# Altium project PSat PSU.PrjPcb
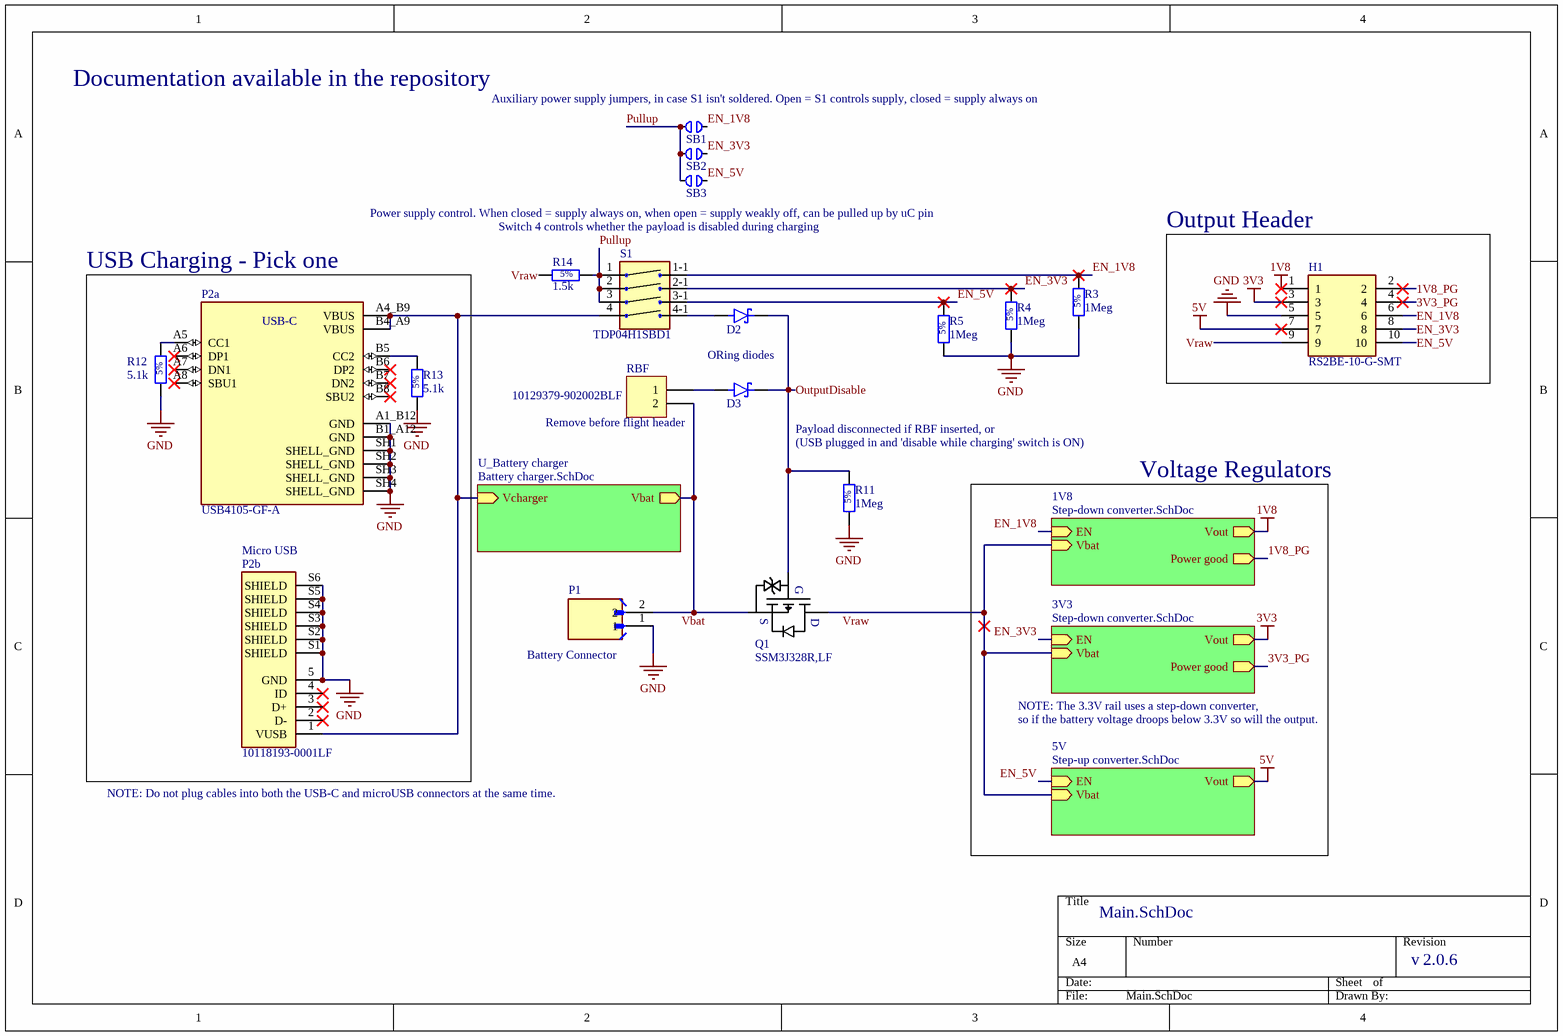
[diagram p0: Main.SchDoc]
Version: 2.0.6
4 sheets, 50 parts. Net scope: hierarchical (ports join the sheet entries above them; power ports are global).
Board file: PSU.PcbDoc
Sheets:
  Main.SchDoc
    1V8 = Step-down converter.SchDoc
    3V3 = Step-down converter.SchDoc
    U_Battery charger = Battery charger.SchDoc
    5V = Step-up converter.SchDoc

## Sheet Main.SchDoc
size A4; SheetNumber: 1; SheetTotal: 4

### Parts
D2  SS0520_R1_00001  [SOD123-1.35mm-N]  (value not drawn)
D3  SS0520_R1_00001  [SOD123-1.35mm-N]  (value not drawn)
H1  RS2BE-10-G-SMT  [RS2BE10GSMT]
P1  B2B-PH-K-S(LF)(SN)  [JST_B2B-PH-K-S(LF)(SN)]  (value not drawn)
P2a  USB4105-GF-A  [GCT_USB4105-GF-A]
P2b  10118193-0001LF  [AMPHENOL_10118193-0001LF]
Q1  SSM3J328R,LF  [SOT23F-3-0.8mm]
R3  1Meg  [Resistor_0805_2012M-50N]
R4  1Meg  [Resistor_0805_2012M-50N]
R5  1Meg  [Resistor_0805_2012M-50N]
R11  1Meg  [Resistor_0805_2012M-50N]
R12  5.1k  [Resistor_0805_2012M-50N]
R13  5.1k  [Resistor_0805_2012M-50N]
R14  1.5k  [Resistor_0805_2012M-50N]
RBF  (no value)  [ECE-600102STTH-RA]  (no BOM)
S1  TDP04H1SBD1  [TDP04H1SBD1]
SB1  Solder Jumper Normally Open 0201  [Solder Bridge Open 0201]  (value not drawn)  (no BOM)
SB2  Solder Jumper Normally Open 0201  [Solder Bridge Open 0201]  (value not drawn)  (no BOM)
SB3  Solder Jumper Normally Open 0201  [Solder Bridge Open 0201]  (value not drawn)  (no BOM)

### Blocks framed on the sheet
Output Header: H1
USB Charging - Pick one: P2a P2b R12 R13

### Sub-sheets
1V8 = Step-down converter.SchDoc: EN (in), Vbat (in), Power good (out), Vout (out)  | R_FB1_Value: 200k; R_FB2_Value: 100k; R_FB1_MFPN: RG2012P-104-D-T5; R_FB2_MFPN: RG2012P-204-D-T5
3V3 = Step-down converter.SchDoc: EN (in), Vbat (in), Power good (out), Vout (out)  | R_FB1_Value: 910k; R_FB2_Value: 200k; R_FB2_MFPN: RG2012P-204-D-T5; R_FB1_MFPN: RG2012P-914-D-T5
5V = Step-up converter.SchDoc: EN (in), Vbat (in), Vout (out)  | R_FB1_Value: 910k; R_FB2_Value: 100k; R_FB1_MFPN: RG2012P-914-D-T5; R_FB2_MFPN: RG2012P-104-D-T5
U_Battery charger = Battery charger.SchDoc: Vbat (out), Vcharger (in)

### Nets
1V8: H1.1 ; sheet 1V8/Vout
3V3: H1.3 ; sheet 3V3/Vout
5V: H1.7 ; sheet 5V/Vout
GND: H1.5 P1.1 P2a.A1_B12(GND) P2a.B1_A12(GND) P2a.SH1(SHELL_GND) P2a.SH2(SHELL_GND) P2a.SH3(SHELL_GND) P2a.SH4(SHELL_GND) P2b.5(GND) P2b.S1(SHIELD) P2b.S2(SHIELD) P2b.S3(SHIELD) P2b.S4(SHIELD) P2b.S5(SHIELD) P2b.S6(SHIELD) R3.1 R4.1 R5.1 R11.1 R12.1 R13.1
1V8_PG: H1.2 ; sheet 1V8/Power good
3V3_PG: H1.4 ; sheet 3V3/Power good
EN_1V8: H1.6 R3.2 S1.8(1-1) SB1.2 ; sheet 1V8/EN
EN_3V3: H1.8 R4.2 S1.7(2-1) SB2.2 ; sheet 3V3/EN
EN_5V: H1.10 R5.2 S1.6(3-1) SB3.2 ; sheet 5V/EN
OutputDisable: D2.C D3.C Q1.1(G) R11.2
Pullup: R14.2 S1.1 S1.2 S1.3 SB1.1 SB2.1 SB3.1
Vbat: P1.2 Q1.2(S) RBF.2 ; sheet U_Battery charger/Vbat
Vraw: H1.9 Q1.3(D) R14.1 ; sheet 1V8/Vbat, sheet 3V3/Vbat, sheet 5V/Vbat
NetC6_2: P2a.A4_B9(VBUS) P2a.B4_A9(VBUS) P2b.1(VUSB) S1.4 ; sheet U_Battery charger/Vcharger
NetD2_A: D2.A S1.5(4-1)
NetD3_A: D3.A RBF.1
NetP2a_A5: P2a.A5(CC1) R12.2
NetP2a_B5: P2a.B5(CC2) R13.2

Not connected (* = marked no-connect by the designer): P2a A6(DP1)* A7(DN1)* A8(SBU1)* B6(DP2)* B7(DN2)* B8(SBU2)*; P2b 2(D-)* 3(D+)* 4(ID)*

### Notes on the sheet
- Documentation available in the repository
- (near SB1) Auxiliary power supply jumpers, in case S1 isn't soldered. Open = S1 controls supply, closed = supply always on
- (near SB3) Power supply control. When closed = supply always on, when open = supply weakly off, can be pulled up by uC pin
- Switch 4 controls whether the payload is disabled during charging
- (near P2a) USB-C
- ORing diodes
- (near RBF) 10129379-902002BLF
- (near RBF) Remove before flight header
- Payload disconnected if RBF inserted, or
- (near R11) (USB plugged in and 'disable while charging' switch is ON)
- Voltage Regulators
- (near P2b) Micro USB
- (near P1) Battery Connector
- NOTE: The 3.3V rail uses a step-down converter,
- so if the battery voltage droops below 3.3V so will the output.
- NOTE: Do not plug cables into both the USB-C and microUSB connectors at the same time.
- v

### Library data of the parts
D2 D3 = SS0520_R1_00001: Diode - Low Forward Voltage, Schottky, 385 mV @ 500 mA, 75 µA Reverse @ 10 V, SOD-123; APSS Standard Part: APSS Standard; Temp Range: -55°C ~ 125°C; Rated Voltage: 20V Reverse; MF Part No.: SS0520_R1_00001; Package: SOD-123; Supplier 1: Digikey; Supplier 1 Part No.: 3757-SS0520_R1_00001CT-ND
H1 = RS2BE-10-G-SMT: Receptacle Strip 10P 2.54mm Pitch SMT; MF Part No.: RS2BE-10-G-SMT; Supplier 1 Part No.: 2057-RS2BE-10-G-SMT-ND; Supplier 1: Digikey
P1 = B2B-PH-K-S(LF)(SN): Connector Header Through Hole 2 position 0.079 (2.00mm); MF Part No.: B2B-PH-K-S (LF)(SN); Supplier 1 Part No.: 455-1704-ND; Supplier 1: Digikey
P2a = USB4105-GF-A: USB-C (USB TYPE-C) USB 2.0 Receptacle Connector 24 (16+8 Dummy) Position Surface Mount, Right Angle; Through Hole; MF Part No.: USB4105-GF-A; Supplier 1 Part No.: 2073-USB4105-GF-ACT-ND; Supplier 1: Digikey
P2b = 10118193-0001LF: Micro USB 2.0, Input Output Connectors, B TYPE RECEPTACLE; MF: Amphenol ICC; MF Part No.: 10118193-0001LF
Q1 = SSM3J328R,LF: Transistor - MOSFET, P-Channel SSM3J328R,LF; APSS Standard Part: APSS Standard; Temp Range: 0°C ~ 150°C (TJ); Rated Voltage: 20 Vds; Power: 1W; MF Part No.: SSM3J328R,LF; Package: SOT23-3; Supplier 1: Digikey; Supplier 1 Part No.: SSM3J328RLFCT-ND
R3-R5 R11 = RMCF0805JT Series: Passive - Resistor Series, 0805, 5%, 100m - 22M, E24, 0.063W, 1/16W, ±200ppm/°C, -55°C ~ 155°C, 0805 (2012 Metric); MF Part No.: RMCF0805JT1M00; APSS Standard Part: APSS Standard; Power: 1/8W; Value Range: 100m ~ 22M; Rated Voltage: 150V; Tolerance: 5%; E Series: E24; Temp Range: -55°C ~ 155°C; Supplier 1: Digikey; Package: 0805; Temperature Coefficient: ±200ppm/°C; Value: 1Meg
R12 R13 = RMCF0805JT Series: Passive - Resistor Series, 0805, 5%, 100m - 22M, E24, 0.063W, 1/16W, ±200ppm/°C, -55°C ~ 155°C, 0805 (2012 Metric); MF Part No.: RMCF0805JT5K10; APSS Standard Part: APSS Standard; Power: 1/8W; Value Range: 100m ~ 22M; Rated Voltage: 150V; Tolerance: 5%; E Series: E24; Temp Range: -55°C ~ 155°C; Supplier 1: Digikey; Package: 0805; Temperature Coefficient: ±200ppm/°C; Value: 5.1k
R14 = RMCF0805JT Series: Passive - Resistor Series, 0805, 5%, 100m - 22M, E24, 0.063W, 1/16W, ±200ppm/°C, -55°C ~ 155°C, 0805 (2012 Metric); MF Part No.: RMCF0805JT1K50; APSS Standard Part: APSS Standard; Power: 1/8W; Value Range: 100m ~ 22M; Rated Voltage: 150V; Tolerance: 5%; E Series: E24; Temp Range: -55°C ~ 155°C; Supplier 1: Digikey; Package: 0805; Temperature Coefficient: ±200ppm/°C; Value: 1.5k
RBF = Header 2: Short Before Flight
S1 = TDP04H1SBD1: Switch; MF Part No.: TDP04H1SBD1; Supplier 1 Part No.: CKN9426-ND; Supplier 1: Digikey
SB1-SB3 = Solder Jumper Normally Open 0201: DEBUG: DEBUG

## Sheet Step-down converter.SchDoc
size A4; SheetNumber: 2; SheetTotal: 4
Used 2 times, as channels 1V8, 3V3. Parts and nets are listed once, with the designators drawn on the sheet.
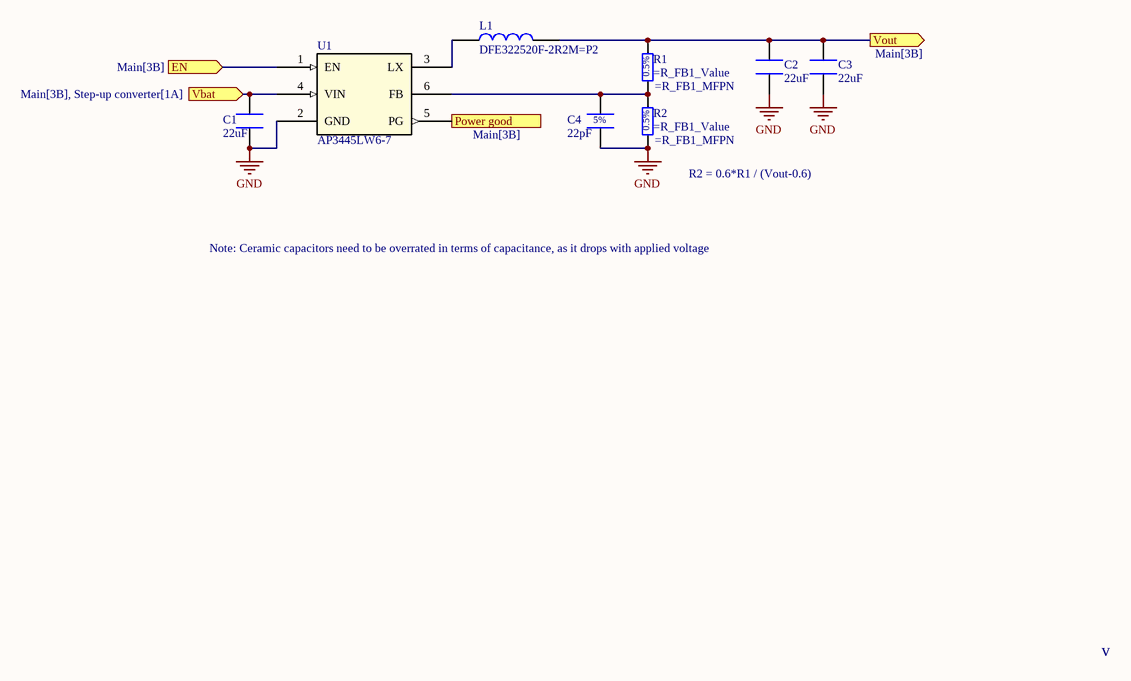
[diagram p1: Step-down converter.SchDoc]

### Parts
C1  22uF  [CAPACITOR_0805_2012M-70N]
C2  22uF  [CAPACITOR_0805_2012M-70N]
C3  22uF  [CAPACITOR_0805_2012M-70N]
C4  22pF  [CAPACITOR_0805_2012M-70N]
L1  DFE322520F-2R2M=P2  [INDC3225X200N]
R1  (no value)  [Resistor_0805_2012M-50N]
R2  (no value)  [Resistor_0805_2012M-50N]
U1  AP3445LW6-7  [SOT23-5N-1.45mm]

### Ports
EN (in, see Main[3B]), Power good (out, see Main[3B]), Vbat (in, see Main[3B], Step-up converter[1A]), Vout (out, see Main[3B])

### Nets
GND: C1.1 C2.1 C3.1 C4.1 R2.1 U1.2(GND)
EN: U1.1(EN) ; port EN
Power good: U1.5(PG) ; port Power good
Vbat: C1.2 U1.4(VIN) ; port Vbat
Vout: C2.2 C3.2 L1.1 R1.2 ; port Vout
NetC4_2: C4.2 R1.1 R2.2 U1.6(FB)
NetL1_2: L1.2 U1.3(LX)

### Channels
1V8: designators end in _1V8; ports EN=EN_1V8 Power good=1V8_PG Vbat=Vraw Vout=1V8
3V3: designators end in _3V3; ports EN=EN_3V3 Power good=3V3_PG Vbat=Vraw Vout=3V3

### Notes on the sheet
- (near R2) R2 = 0.6*R1 / (Vout-0.6)
- Note: Ceramic capacitors need to be overrated in terms of capacitance, as it drops with applied voltage
- v

### Library data of the parts
C1-C3 = C0805C226M9PACTU: Passive - Capacitor, X5R, 22uF Max, 6.3V, 0805 (2012 Metric), ±20%, -55°C ~ 85°C. 8.8uF @ 5V; APSS Standard Part: APSS Standard; Capacitance at Rated Voltage: 30%; Tolerance: ±20%; Temperature Coefficient: X5R; Rated Voltage: 6.3V; Temp Range: -55°C ~ 85°C; Package: 0805; Supplier 1: Digikey; Supplier 1 Part No.: 399-C0805C226M9PAC7800CT-ND; MF Part No.: C0805C226M9PACTU; Value: 22uF
C4 = Generic Capacitor: MF Part No.: C0805C220J5GACTU; Tolerance: 5%; Temperature Coefficient: C0G; Rated Voltage: 50V; Capacitance at Rated Voltage: 100%; Temp Range: -55 ~ 125C; Supplier 1: Digikey; Supplier 1 Part No.: 399-C0805C220J5GAC7800CT-ND; Package: 0805; Value: 22pF
L1 = DFE322520F-2R2M=P2: 2.2 H Shielded Wirewound Inductor 3.3 A 40mOhm Max 1210 (3225 Metric); MF Part No.: DFE322520F-2R2M=P2; Supplier 1 Part No.: 490-DFE322520F-2R2M=P2CT-ND; Supplier 1: Digikey
R1 R2 = RG2012P-xxx-D-T5 Series: Passive - Resistor Series, 0805, 0.5%, 10 - 1M, E24, 0.063W, 1/8W, ±25ppm/°C, -55°C ~ 155°C, 0805 (2012 Metric); APSS Standard Part: APSS Standard; Value Range: 10 ~ 1M; Rated Voltage: 150V; Tolerance: 0.5%; Power: 1/8W; E Series: E24; Temp Range: -55°C ~ 155°C; Supplier 1: Digikey; Package: 0805; Temperature Coefficient: ±25ppm/°C; MF Part No.: =R_FB1_MFPN; Value: =R_FB1_Value
U1 = AP3445LW6-7: IC - Regulator, Buck, 2A, 2.7V to 5.5V In, 0.6V to Vin Out, SOT23-6; APSS Standard Part: APSS Standard; Temp Range: -40°C ~ 85°C (TA); MF Part No.: AP3445LW6-7; Package: SOT-23-5; Supplier 1: Digikey; Supplier 1 Part No.: AP3445LW6-7DICT-ND; Rated Voltage: 5.5V

## Sheet Battery charger.SchDoc
size A4; SheetNumber: 3; SheetTotal: 4
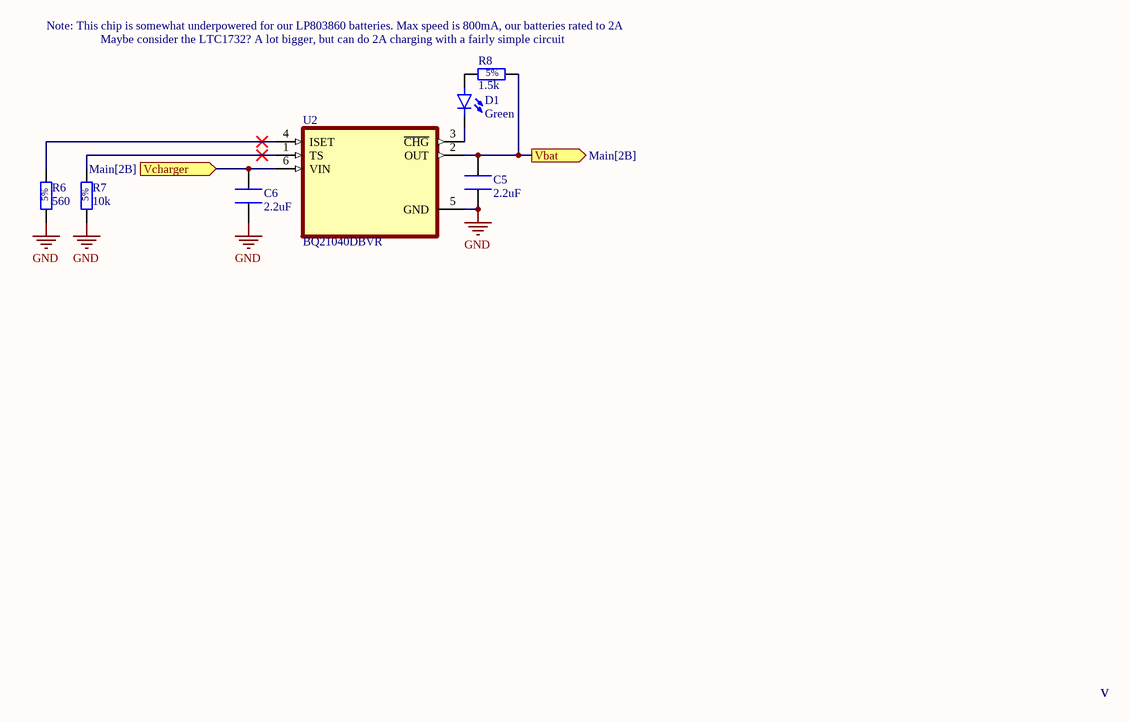
[diagram p2: Battery charger.SchDoc]

### Parts
C5  2.2uF  [CAPACITOR_0805_2012M-70N]
C6  2.2uF  [CAPACITOR_0805_2012M-70N]
D1  Colour: Green  [LED_0603_1608M_0.80mm]  (hidden comment: LTST-C190 Series)
R6  560  [Resistor_0805_2012M-50N]
R7  10k  [Resistor_0805_2012M-50N]
R8  1.5k  [Resistor_0805_2012M-50N]
U2  BQ21040DBVR  [SOT95P280X145-6N]

### Ports
Vbat (out, see Main[2B]), Vcharger (in, see Main[2B])

### Nets
GND: C5.2 C6.1 R6.1 R7.1 U2.5(GND)
Vbat: C5.1 R8.2 U2.2(OUT) ; port Vbat
NetC6_2: C6.2 U2.6(VIN) ; port Vcharger
NetD1_A: D1.A R8.1
NetD1_C: D1.C U2.3(~{CHG})
NetR6_2: R6.2 U2.4(ISET)
NetR7_2: R7.2 U2.1(TS)

### Notes on the sheet
- Note: This chip is somewhat underpowered for our LP803860 batteries. Max speed is 800mA, our batteries rated to 2A
- Maybe consider the LTC1732? A lot bigger, but can do 2A charging with a fairly simple circuit
- v

### Library data of the parts
C5 C6 = C0805C225K8PACTU: Passive - Capacitor, X5R, 2.2uF Max, 10V, 0805 (2012 Metric), ±10%, -55°C ~ 85°C. 2uF @ 5V, 1.1uF @ 10V; APSS Standard Part: APSS Standard; Capacitance at Rated Voltage: 50%; Tolerance: ±10%; Temperature Coefficient: X5R; Rated Voltage: 10V; Temp Range: -55°C ~ 85°C; Package: 0805; Supplier 1: Digikey; Supplier 1 Part No.: 399-C0805C225K8PAC7800-ND; MF Part No.: C0805C225K8PACTU; Value: 2.2uF
D1 = LTST-C190 Series: Diode - LED, 0603; MF Part No.: LTST-C190KGKT; APSS Standard Part: APSS Standard; Temp Range: -30°C ~ 85°C; Rated Voltage: 5V Reverse; Package: 0603; Supplier 1: Digikey; Supplier 1 Part No.: 160-1435-1-ND
R6 = RMCF0805JT Series: Passive - Resistor Series, 0805, 5%, 100m - 22M, E24, 0.063W, 1/16W, ±200ppm/°C, -55°C ~ 155°C, 0805 (2012 Metric); MF Part No.: RMCF0805JT560R; APSS Standard Part: APSS Standard; Power: 1/8W; Value Range: 100m ~ 22M; Rated Voltage: 150V; Tolerance: 5%; E Series: E24; Temp Range: -55°C ~ 155°C; Supplier 1: Digikey; Package: 0805; Temperature Coefficient: ±200ppm/°C; Value: 560
R7 = RMCF0805JT Series: Passive - Resistor Series, 0805, 5%, 100m - 22M, E24, 0.063W, 1/16W, ±200ppm/°C, -55°C ~ 155°C, 0805 (2012 Metric); MF Part No.: RMCF0805JT10K0; APSS Standard Part: APSS Standard; Power: 1/8W; Value Range: 100m ~ 22M; Rated Voltage: 150V; Tolerance: 5%; E Series: E24; Temp Range: -55°C ~ 155°C; Supplier 1: Digikey; Package: 0805; Temperature Coefficient: ±200ppm/°C; Value: 10k
R8 = RMCF0805JT Series: as R14 on sheet Main; Tolerance: 5%; E Series: E24; Temp Range: -55°C ~ 155°C; Supplier 1: Digikey; Package: 0805; Temperature Coefficient: ±200ppm/°C; Value: 1.5k
U2 = BQ21040DBVR: 1-cell, 0.8-A Li-ion and Li-polymer battery charger; MF: Texas Instruments; Package: SOT23-6; MF Part No.: BQ21040DBVR; Value: *; Supplier 1 Part No.: 296-47315-1-ND; Supplier 1: Digikey

## Sheet Step-up converter.SchDoc
size A4; SheetNumber: 4; SheetTotal: 4
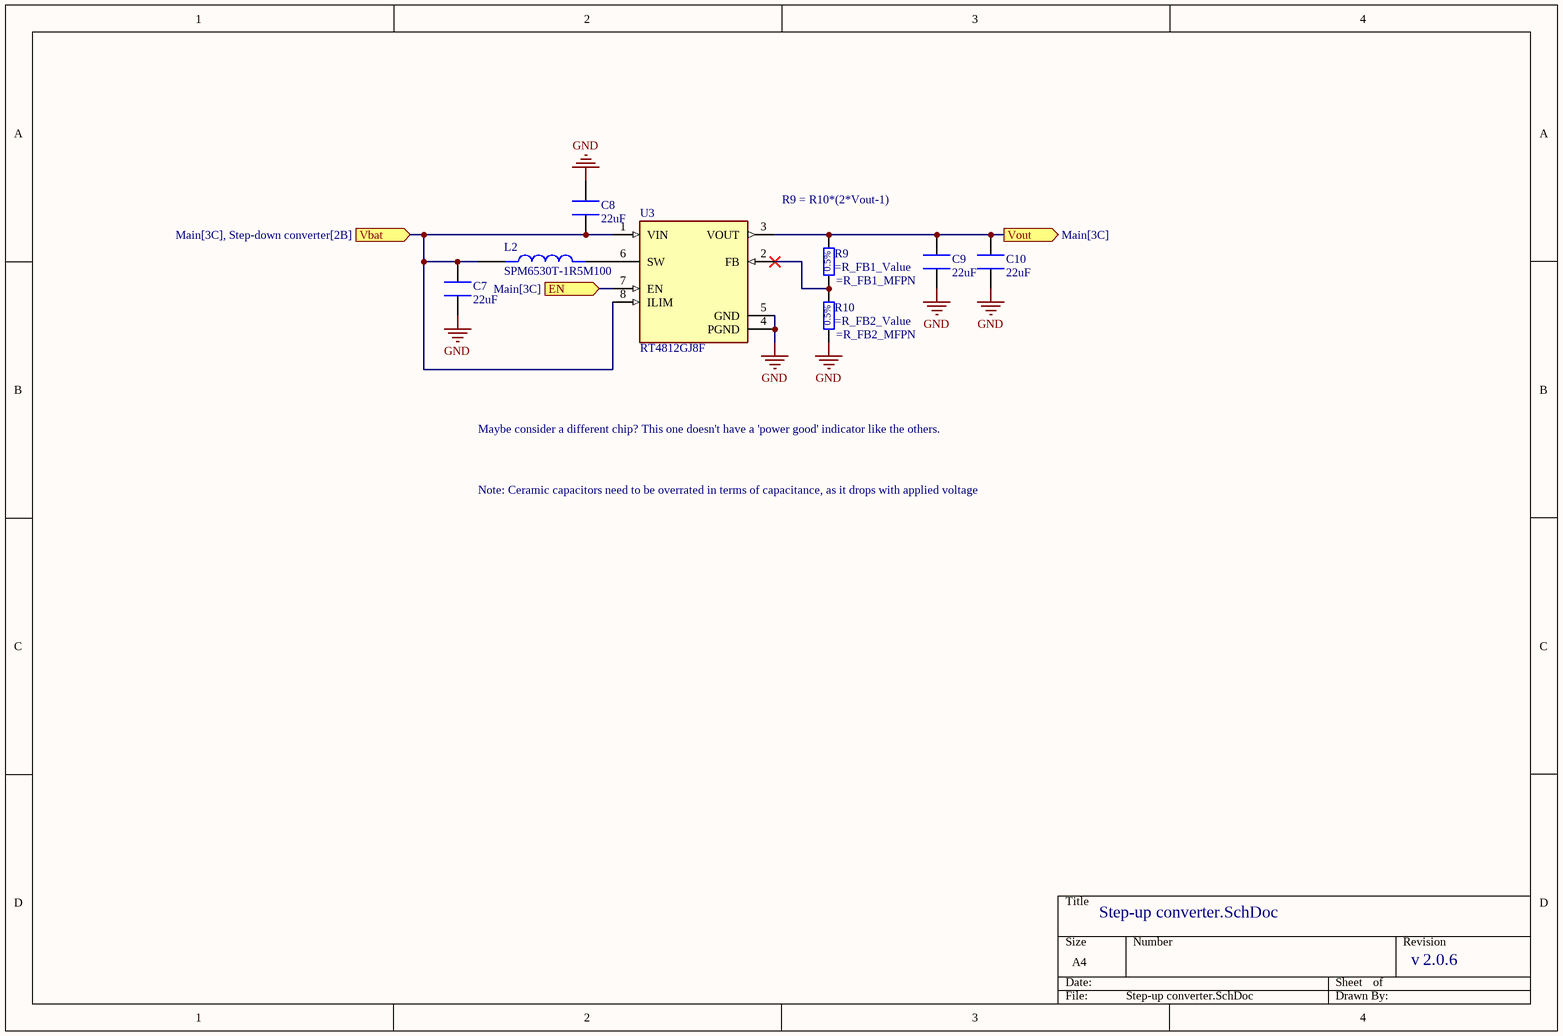
[diagram p3: Step-up converter.SchDoc]

### Parts
C7  22uF  [CAPACITOR_0805_2012M-70N]
C8  22uF  [CAPACITOR_0805_2012M-70N]
C9  22uF  [CAPACITOR_0805_2012M-70N]
C10  22uF  [CAPACITOR_0805_2012M-70N]
L2  SPM6530T-1R5M100  [IND_SPM6530T-1R5M100]
R9  (no value)  [Resistor_0805_2012M-50N]
R10  (no value)  [Resistor_0805_2012M-50N]
U3  RT4812GJ8F  [SOT28-8N-1.45mm]

### Ports
EN (in, see Main[3C]), Vbat (in, see Main[3C], Step-down converter[2B]), Vout (out, see Main[3C])

### Nets
5V: C9.2 C10.2 R9.2 U3.3(VOUT) ; port Vout
GND: C7.1 C8.2 C9.1 C10.1 R10.1 U3.4(PGND) U3.5(GND)
EN_5V: U3.7(EN) ; port EN
Vraw: C7.2 C8.1 L2.1 U3.1(VIN) U3.8(ILIM) ; port Vbat
NetL2_2: L2.2 U3.6(SW)
NetR9_1: R9.1 R10.2 U3.2(FB)

### Notes on the sheet
- R9 = R10*(2*Vout-1)
- Maybe consider a different chip? This one doesn't have a 'power good' indicator like the others.
- Note: Ceramic capacitors need to be overrated in terms of capacitance, as it drops with applied voltage
- v

### Library data of the parts
C7-C10 = C0805C226M9PACTU: as C1 on sheet Step-down converter; Tolerance: ±20%; Temperature Coefficient: X5R; Rated Voltage: 6.3V; Temp Range: -55°C ~ 85°C; Package: 0805; Supplier 1: Digikey; Supplier 1 Part No.: 399-C0805C226M9PAC7800CT-ND; MF Part No.: C0805C226M9PACTU; Value: 22uF
L2 = SPM6530T-1R5M100: 1.5 ÂµH Shielded Drum Core, Wirewound Inductor 11 A 10.67mOhm Max Nonstandard; MF: TDK; Supplier 1: Digikey; Supplier 1 Part No.: 445-3881-2-ND; MF Part No.: SPM6530T-1R5M100
R9 R10 = RG2012P-xxx-D-T5 Series: as R1 on sheet Step-down converter; Tolerance: 0.5%; Power: 1/8W; E Series: E24; Temp Range: -55°C ~ 155°C; Supplier 1: Digikey; Package: 0805; Temperature Coefficient: ±25ppm/°C
  R9: MF Part No.: =R_FB1_MFPN; Value: =R_FB1_Value
  R10: MF Part No.: =R_FB2_MFPN; Value: =R_FB2_Value
U3 = RT4812GJ8F: Boost Switching Regulator IC Positive Adjustable 1.8V 1 Output 2A SOT-23-8 Thin, TSOT-23-8; APSS Standard Part: APSS Standard; Rated Voltage: 5.5V; Temp Range: -40°C ~ 85°C (TA); Package: SOT-28-8; MF Part No.: RT4812GJ8F; Supplier 1: Digikey; Supplier 1 Part No.: 1028-1512-1-ND

## Nets that join several sheets
1V8: Main (H1.1), 1V8 (C2_1V8.2 C3_1V8.2 L1_1V8.1 R1_1V8.2)
3V3: Main (H1.3), 3V3 (C2_3V3.2 C3_3V3.2 L1_3V3.1 R1_3V3.2)
5V: Main (H1.7), Step-up converter (C9.2 C10.2 R9.2 U3.3)
GND: Main (21 pins), 1V8 (6 pins), 3V3 (6 pins), Battery charger (5 pins), Step-up converter (7 pins)
1V8_PG: Main (H1.2), 1V8 (U1_1V8.5)
3V3_PG: Main (H1.4), 3V3 (U1_3V3.5)
EN_1V8: Main (H1.6 R3.2 S1.8 SB1.2), 1V8 (U1_1V8.1)
EN_3V3: Main (H1.8 R4.2 S1.7 SB2.2), 3V3 (U1_3V3.1)
EN_5V: Main (H1.10 R5.2 S1.6 SB3.2), Step-up converter (U3.7)
NetC6_2: Main (P2a.A4_B9 P2a.B4_A9 P2b.1 S1.4), Battery charger (C6.2 U2.6)
Vbat: Main (P1.2 Q1.2 RBF.2), Battery charger (C5.1 R8.2 U2.2)
Vraw: Main (H1.9 Q1.3 R14.1), 1V8 (C1_1V8.2 U1_1V8.4), 3V3 (C1_3V3.2 U1_3V3.4), Step-up converter (5 pins)

## Assembly variants
USB-C: not fitted P2
Micro USB: not fitted J2a